# EasyEDA schematic SCH_Pico Keyboard V2.0_2022-02-22.json

## Sheets
1 Mtrix
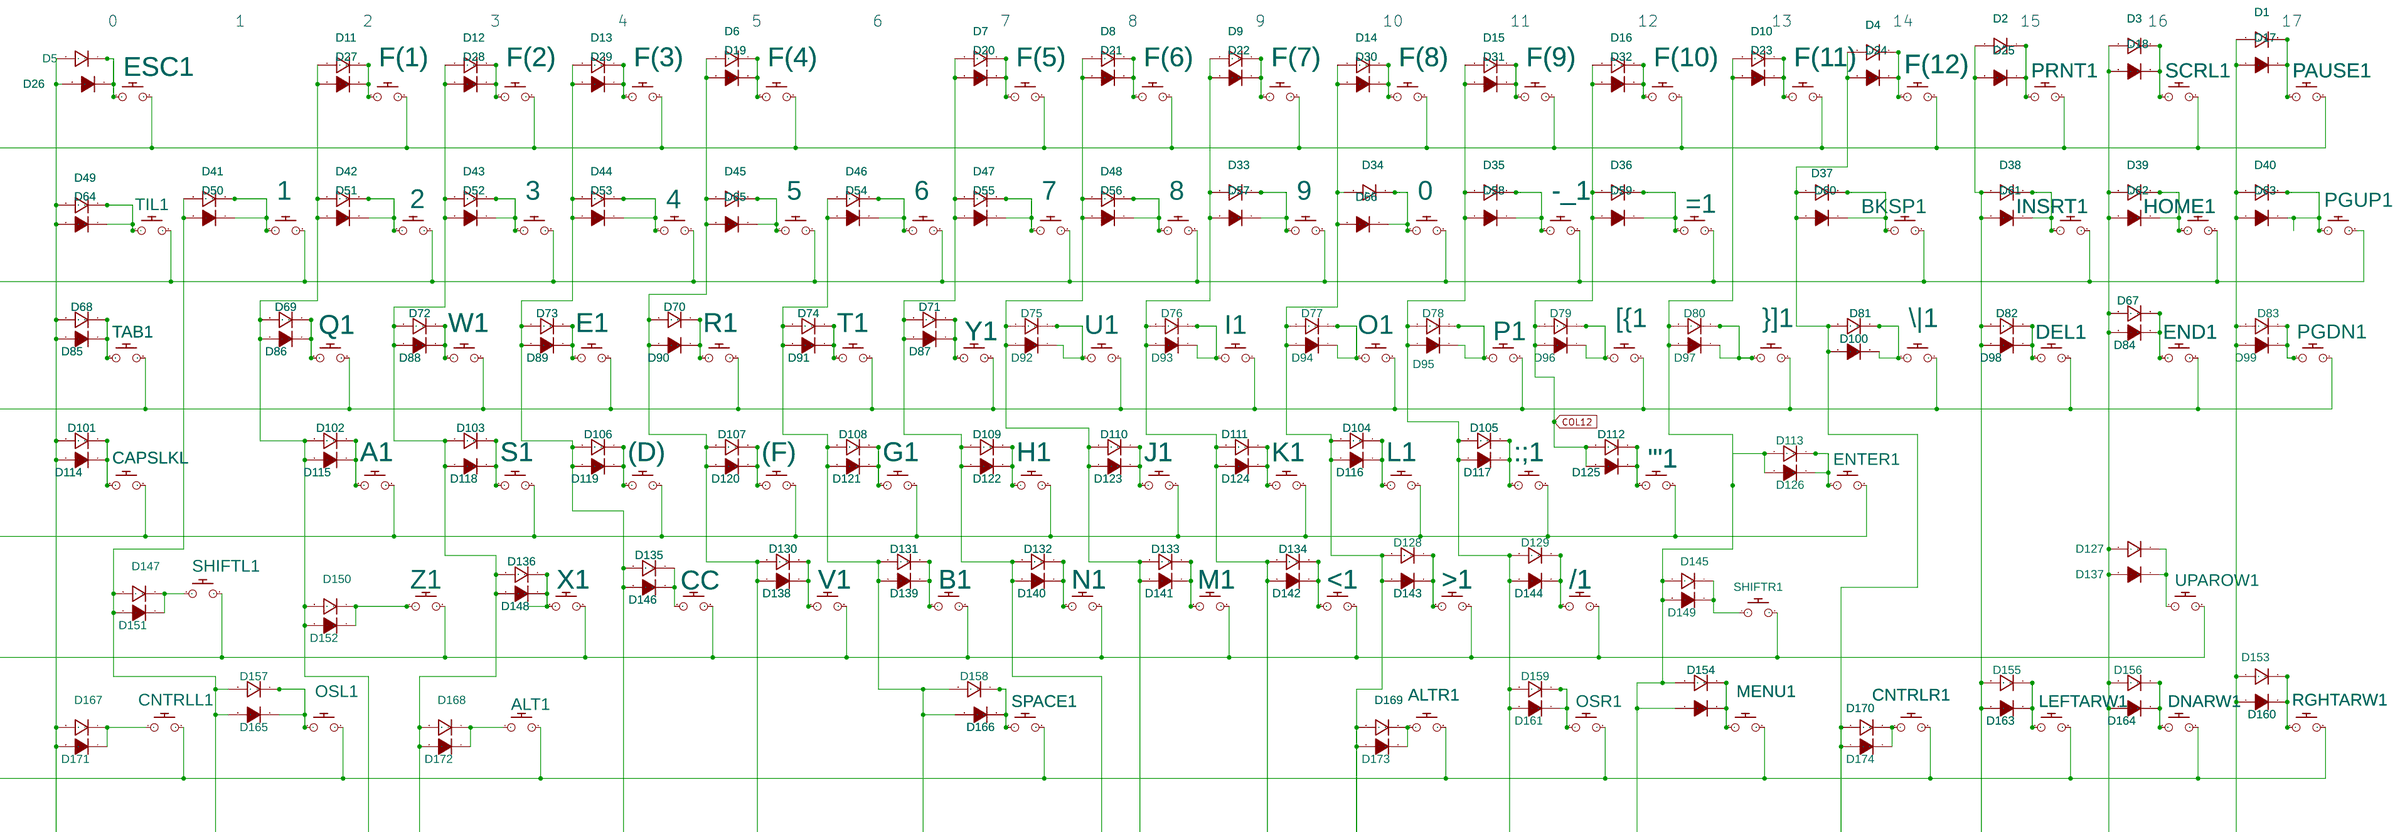
[diagram p0: Mtrix]
2 Pico
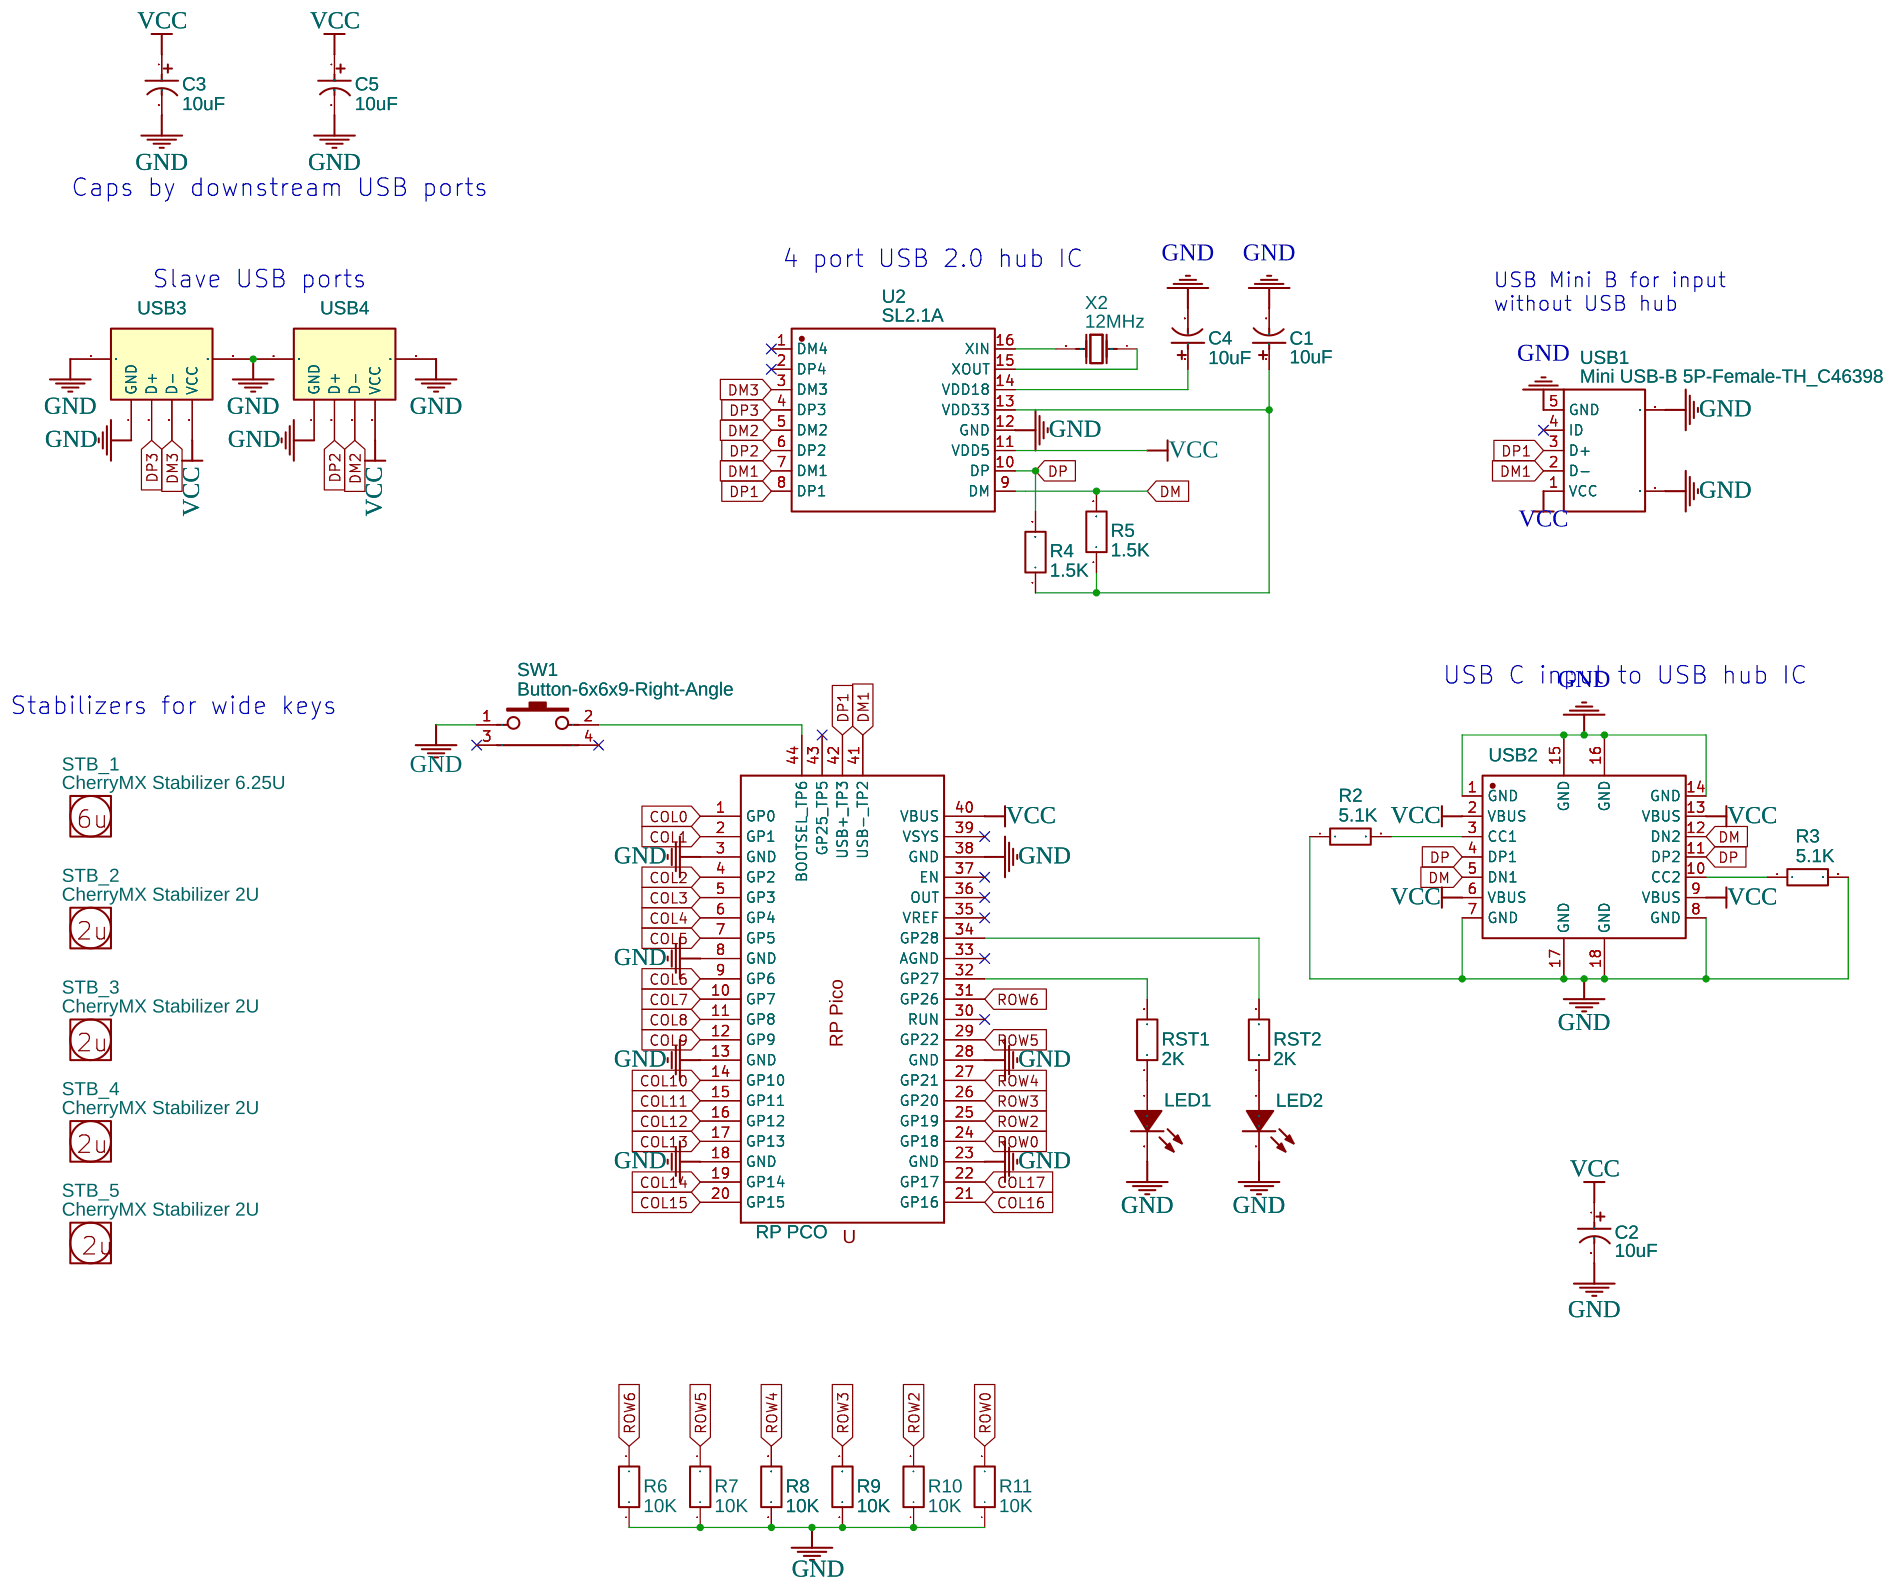
[diagram p1: Pico]

## Parts
sheet Mtrix
0  Cherry MX  [CHERRY MX]
1  Cherry MX  [CHERRY MX]
2  Cherry MX  [CHERRY MX]
3  Cherry MX  [CHERRY MX]
4  Cherry MX  [CHERRY MX]
5  Cherry MX  [CHERRY MX]
6  Cherry MX  [CHERRY MX]
7  Cherry MX  [CHERRY MX]
8  Cherry MX  [CHERRY MX]
9  Cherry MX  [CHERRY MX]
'"1  Cherry MX  [CHERRY MX]
(D)  Cherry MX  [CHERRY MX]
(F)  Cherry MX  [CHERRY MX]
-_1  Cherry MX  [CHERRY MX]
/1  Cherry MX  [CHERRY MX]
:;1  Cherry MX  [CHERRY MX]
<1  Cherry MX  [CHERRY MX]
=1  Cherry MX  [CHERRY MX]
>1  Cherry MX  [CHERRY MX]
[{1  Cherry MX  [CHERRY MX]
\|1  Cherry MX  [CHERRY MX]
A1  Cherry MX  [CHERRY MX]
ALT1  Cherry MX  [CHERRY MX]
ALTR1  Cherry MX  [CHERRY MX]
B1  Cherry MX  [CHERRY MX]
BKSP1  Cherry MX  [CHERRY MX]
CAPSLKL  Cherry MX  [CHERRY MX]
CC  Cherry MX  [CHERRY MX]
CNTRLL1  Cherry MX  [CHERRY MX]
CNTRLR1  Cherry MX  [CHERRY MX]
D1  1N4148-C163750  [DO-35_BD2.0-L4.2-P8.20-D0.5-RD]
D2  1N4148-C163750  [DO-35_BD2.0-L4.2-P8.20-D0.5-RD]
D3  1N4148-C163750  [DO-35_BD2.0-L4.2-P8.20-D0.5-RD]
D4  1N4148-C163750  [DO-35_BD2.0-L4.2-P8.20-D0.5-RD]
D5  1N4148-C163750  [DO-35_BD2.0-L4.2-P8.20-D0.5-RD]
D6  1N4148-C163750  [DO-35_BD2.0-L4.2-P8.20-D0.5-RD]
D7  1N4148-C163750  [DO-35_BD2.0-L4.2-P8.20-D0.5-RD]
D8  1N4148-C163750  [DO-35_BD2.0-L4.2-P8.20-D0.5-RD]
D9  1N4148-C163750  [DO-35_BD2.0-L4.2-P8.20-D0.5-RD]
D10  1N4148-C163750  [DO-35_BD2.0-L4.2-P8.20-D0.5-RD]
D11  1N4148-C163750  [DO-35_BD2.0-L4.2-P8.20-D0.5-RD]
D12  1N4148-C163750  [DO-35_BD2.0-L4.2-P8.20-D0.5-RD]
D13  1N4148-C163750  [DO-35_BD2.0-L4.2-P8.20-D0.5-RD]
D14  1N4148-C163750  [DO-35_BD2.0-L4.2-P8.20-D0.5-RD]
D15  1N4148-C163750  [DO-35_BD2.0-L4.2-P8.20-D0.5-RD]
D16  1N4148-C163750  [DO-35_BD2.0-L4.2-P8.20-D0.5-RD]
D17  1N4148WS T4  [SOD-323_L1.8-W1.3-LS2.5-RD]
D18  1N4148WS T4  [SOD-323_L1.8-W1.3-LS2.5-RD]
D19  1N4148WS T4  [SOD-323_L1.8-W1.3-LS2.5-RD]
D20  1N4148WS T4  [SOD-323_L1.8-W1.3-LS2.5-RD]
D21  1N4148WS T4  [SOD-323_L1.8-W1.3-LS2.5-RD]
D22  1N4148WS T4  [SOD-323_L1.8-W1.3-LS2.5-RD]
D23  1N4148WS T4  [SOD-323_L1.8-W1.3-LS2.5-RD]
D24  1N4148WS T4  [SOD-323_L1.8-W1.3-LS2.5-RD]
D25  1N4148WS T4  [SOD-323_L1.8-W1.3-LS2.5-RD]
D26  1N4148WS T4  [SOD-323_L1.8-W1.3-LS2.5-RD]
D27  1N4148WS T4  [SOD-323_L1.8-W1.3-LS2.5-RD]
D28  1N4148WS T4  [SOD-323_L1.8-W1.3-LS2.5-RD]
D29  1N4148WS T4  [SOD-323_L1.8-W1.3-LS2.5-RD]
D30  1N4148WS T4  [SOD-323_L1.8-W1.3-LS2.5-RD]
D31  1N4148WS T4  [SOD-323_L1.8-W1.3-LS2.5-RD]
D32  1N4148WS T4  [SOD-323_L1.8-W1.3-LS2.5-RD]
D33  1N4148-C163750  [DO-35_BD2.0-L4.2-P8.20-D0.5-RD]
D34  1N4148-C163750  [DO-35_BD2.0-L4.2-P8.20-D0.5-RD]
D35  1N4148-C163750  [DO-35_BD2.0-L4.2-P8.20-D0.5-RD]
D36  1N4148-C163750  [DO-35_BD2.0-L4.2-P8.20-D0.5-RD]
D37  1N4148-C163750  [DO-35_BD2.0-L4.2-P8.20-D0.5-RD]
D38  1N4148-C163750  [DO-35_BD2.0-L4.2-P8.20-D0.5-RD]
D39  1N4148-C163750  [DO-35_BD2.0-L4.2-P8.20-D0.5-RD]
D40  1N4148-C163750  [DO-35_BD2.0-L4.2-P8.20-D0.5-RD]
D41  1N4148-C163750  [DO-35_BD2.0-L4.2-P8.20-D0.5-RD]
D42  1N4148-C163750  [DO-35_BD2.0-L4.2-P8.20-D0.5-RD]
D43  1N4148-C163750  [DO-35_BD2.0-L4.2-P8.20-D0.5-RD]
D44  1N4148-C163750  [DO-35_BD2.0-L4.2-P8.20-D0.5-RD]
D45  1N4148-C163750  [DO-35_BD2.0-L4.2-P8.20-D0.5-RD]
D46  1N4148-C163750  [DO-35_BD2.0-L4.2-P8.20-D0.5-RD]
D47  1N4148-C163750  [DO-35_BD2.0-L4.2-P8.20-D0.5-RD]
D48  1N4148-C163750  [DO-35_BD2.0-L4.2-P8.20-D0.5-RD]
D49  1N4148-C163750  [DO-35_BD2.0-L4.2-P8.20-D0.5-RD]
D50  1N4148WS T4  [SOD-323_L1.8-W1.3-LS2.5-RD]
D51  1N4148WS T4  [SOD-323_L1.8-W1.3-LS2.5-RD]
D52  1N4148WS T4  [SOD-323_L1.8-W1.3-LS2.5-RD]
D53  1N4148WS T4  [SOD-323_L1.8-W1.3-LS2.5-RD]
D54  1N4148WS T4  [SOD-323_L1.8-W1.3-LS2.5-RD]
D55  1N4148WS T4  [SOD-323_L1.8-W1.3-LS2.5-RD]
D56  1N4148WS T4  [SOD-323_L1.8-W1.3-LS2.5-RD]
D57  1N4148WS T4  [SOD-323_L1.8-W1.3-LS2.5-RD]
D58  1N4148WS T4  [SOD-323_L1.8-W1.3-LS2.5-RD]
D59  1N4148WS T4  [SOD-323_L1.8-W1.3-LS2.5-RD]
D60  1N4148WS T4  [SOD-323_L1.8-W1.3-LS2.5-RD]
D61  1N4148WS T4  [SOD-323_L1.8-W1.3-LS2.5-RD]
D62  1N4148WS T4  [SOD-323_L1.8-W1.3-LS2.5-RD]
D63  1N4148WS T4  [SOD-323_L1.8-W1.3-LS2.5-RD]
D64  1N4148WS T4  [SOD-323_L1.8-W1.3-LS2.5-RD]
D65  1N4148WS T4  [SOD-323_L1.8-W1.3-LS2.5-RD]
D66  1N4148WS T4  [SOD-323_L1.8-W1.3-LS2.5-RD]
D67  1N4148-C163750  [DO-35_BD2.0-L4.2-P8.20-D0.5-RD]
D68  1N4148-C163750  [DO-35_BD2.0-L4.2-P8.20-D0.5-RD]
D69  1N4148-C163750  [DO-35_BD2.0-L4.2-P8.20-D0.5-RD]
D70  1N4148-C163750  [DO-35_BD2.0-L4.2-P8.20-D0.5-RD]
D71  1N4148-C163750  [DO-35_BD2.0-L4.2-P8.20-D0.5-RD]
D72  1N4148-C163750  [DO-35_BD2.0-L4.2-P8.20-D0.5-RD]
D73  1N4148-C163750  [DO-35_BD2.0-L4.2-P8.20-D0.5-RD]
D74  1N4148-C163750  [DO-35_BD2.0-L4.2-P8.20-D0.5-RD]
D75  1N4148-C163750  [DO-35_BD2.0-L4.2-P8.20-D0.5-RD]
D76  1N4148-C163750  [DO-35_BD2.0-L4.2-P8.20-D0.5-RD]
D77  1N4148-C163750  [DO-35_BD2.0-L4.2-P8.20-D0.5-RD]
D78  1N4148-C163750  [DO-35_BD2.0-L4.2-P8.20-D0.5-RD]
D79  1N4148-C163750  [DO-35_BD2.0-L4.2-P8.20-D0.5-RD]
D80  1N4148-C163750  [DO-35_BD2.0-L4.2-P8.20-D0.5-RD]
D81  1N4148-C163750  [DO-35_BD2.0-L4.2-P8.20-D0.5-RD]
D82  1N4148-C163750  [DO-35_BD2.0-L4.2-P8.20-D0.5-RD]
D83  1N4148-C163750  [DO-35_BD2.0-L4.2-P8.20-D0.5-RD]
D84  1N4148WS T4  [SOD-323_L1.8-W1.3-LS2.5-RD]
D85  1N4148WS T4  [SOD-323_L1.8-W1.3-LS2.5-RD]
D86  1N4148WS T4  [SOD-323_L1.8-W1.3-LS2.5-RD]
D87  1N4148WS T4  [SOD-323_L1.8-W1.3-LS2.5-RD]
D88  1N4148WS T4  [SOD-323_L1.8-W1.3-LS2.5-RD]
D89  1N4148WS T4  [SOD-323_L1.8-W1.3-LS2.5-RD]
D90  1N4148WS T4  [SOD-323_L1.8-W1.3-LS2.5-RD]
D91  1N4148WS T4  [SOD-323_L1.8-W1.3-LS2.5-RD]
D92  1N4148WS T4  [SOD-323_L1.8-W1.3-LS2.5-RD]
D93  1N4148WS T4  [SOD-323_L1.8-W1.3-LS2.5-RD]
D94  1N4148WS T4  [SOD-323_L1.8-W1.3-LS2.5-RD]
D95  1N4148WS T4  [SOD-323_L1.8-W1.3-LS2.5-RD]
D96  1N4148WS T4  [SOD-323_L1.8-W1.3-LS2.5-RD]
D97  1N4148WS T4  [SOD-323_L1.8-W1.3-LS2.5-RD]
D98  1N4148WS T4  [SOD-323_L1.8-W1.3-LS2.5-RD]
D99  1N4148WS T4  [SOD-323_L1.8-W1.3-LS2.5-RD]
D100  1N4148WS T4  [SOD-323_L1.8-W1.3-LS2.5-RD]
D101  1N4148-C163750  [DO-35_BD2.0-L4.2-P8.20-D0.5-RD]
D102  1N4148-C163750  [DO-35_BD2.0-L4.2-P8.20-D0.5-RD]
D103  1N4148-C163750  [DO-35_BD2.0-L4.2-P8.20-D0.5-RD]
D104  1N4148-C163750  [DO-35_BD2.0-L4.2-P8.20-D0.5-RD]
D105  1N4148-C163750  [DO-35_BD2.0-L4.2-P8.20-D0.5-RD]
D106  1N4148-C163750  [DO-35_BD2.0-L4.2-P8.20-D0.5-RD]
D107  1N4148-C163750  [DO-35_BD2.0-L4.2-P8.20-D0.5-RD]
D108  1N4148-C163750  [DO-35_BD2.0-L4.2-P8.20-D0.5-RD]
D109  1N4148-C163750  [DO-35_BD2.0-L4.2-P8.20-D0.5-RD]
D110  1N4148-C163750  [DO-35_BD2.0-L4.2-P8.20-D0.5-RD]
D111  1N4148-C163750  [DO-35_BD2.0-L4.2-P8.20-D0.5-RD]
D112  1N4148-C163750  [DO-35_BD2.0-L4.2-P8.20-D0.5-RD]
D113  1N4148-C163750  [DO-35_BD2.0-L4.2-P8.20-D0.5-RD]
D114  1N4148WS T4  [SOD-323_L1.8-W1.3-LS2.5-RD]
D115  1N4148WS T4  [SOD-323_L1.8-W1.3-LS2.5-RD]
D116  1N4148WS T4  [SOD-323_L1.8-W1.3-LS2.5-RD]
D117  1N4148WS T4  [SOD-323_L1.8-W1.3-LS2.5-RD]
D118  1N4148WS T4  [SOD-323_L1.8-W1.3-LS2.5-RD]
D119  1N4148WS T4  [SOD-323_L1.8-W1.3-LS2.5-RD]
D120  1N4148WS T4  [SOD-323_L1.8-W1.3-LS2.5-RD]
D121  1N4148WS T4  [SOD-323_L1.8-W1.3-LS2.5-RD]
D122  1N4148WS T4  [SOD-323_L1.8-W1.3-LS2.5-RD]
D123  1N4148WS T4  [SOD-323_L1.8-W1.3-LS2.5-RD]
D124  1N4148WS T4  [SOD-323_L1.8-W1.3-LS2.5-RD]
D125  1N4148WS T4  [SOD-323_L1.8-W1.3-LS2.5-RD]
D126  1N4148WS T4  [SOD-323_L1.8-W1.3-LS2.5-RD]
D127  1N4148-C163750  [DO-35_BD2.0-L4.2-P8.20-D0.5-RD]
D128  1N4148-C163750  [DO-35_BD2.0-L4.2-P8.20-D0.5-RD]
D129  1N4148-C163750  [DO-35_BD2.0-L4.2-P8.20-D0.5-RD]
D130  1N4148-C163750  [DO-35_BD2.0-L4.2-P8.20-D0.5-RD]
D131  1N4148-C163750  [DO-35_BD2.0-L4.2-P8.20-D0.5-RD]
D132  1N4148-C163750  [DO-35_BD2.0-L4.2-P8.20-D0.5-RD]
D133  1N4148-C163750  [DO-35_BD2.0-L4.2-P8.20-D0.5-RD]
D134  1N4148-C163750  [DO-35_BD2.0-L4.2-P8.20-D0.5-RD]
D135  1N4148-C163750  [DO-35_BD2.0-L4.2-P8.20-D0.5-RD]
D136  1N4148-C163750  [DO-35_BD2.0-L4.2-P8.20-D0.5-RD]
D137  1N4148WS T4  [SOD-323_L1.8-W1.3-LS2.5-RD]
D138  1N4148WS T4  [SOD-323_L1.8-W1.3-LS2.5-RD]
D139  1N4148WS T4  [SOD-323_L1.8-W1.3-LS2.5-RD]
D140  1N4148WS T4  [SOD-323_L1.8-W1.3-LS2.5-RD]
D141  1N4148WS T4  [SOD-323_L1.8-W1.3-LS2.5-RD]
D142  1N4148WS T4  [SOD-323_L1.8-W1.3-LS2.5-RD]
D143  1N4148WS T4  [SOD-323_L1.8-W1.3-LS2.5-RD]
D144  1N4148WS T4  [SOD-323_L1.8-W1.3-LS2.5-RD]
D145  1N4148-C163750  [DO-35_BD2.0-L4.2-P8.20-D0.5-RD]
D146  1N4148WS T4  [SOD-323_L1.8-W1.3-LS2.5-RD]
D147  1N4148-C163750  [DO-35_BD2.0-L4.2-P8.20-D0.5-RD]
D148  1N4148WS T4  [SOD-323_L1.8-W1.3-LS2.5-RD]
D149  1N4148WS T4  [SOD-323_L1.8-W1.3-LS2.5-RD]
D150  1N4148-C163750  [DO-35_BD2.0-L4.2-P8.20-D0.5-RD]
D151  1N4148WS T4  [SOD-323_L1.8-W1.3-LS2.5-RD]
D152  1N4148WS T4  [SOD-323_L1.8-W1.3-LS2.5-RD]
D153  1N4148-C163750  [DO-35_BD2.0-L4.2-P8.20-D0.5-RD]
D154  1N4148-C163750  [DO-35_BD2.0-L4.2-P8.20-D0.5-RD]
D155  1N4148-C163750  [DO-35_BD2.0-L4.2-P8.20-D0.5-RD]
D156  1N4148-C163750  [DO-35_BD2.0-L4.2-P8.20-D0.5-RD]
D157  1N4148-C163750  [DO-35_BD2.0-L4.2-P8.20-D0.5-RD]
D158  1N4148-C163750  [DO-35_BD2.0-L4.2-P8.20-D0.5-RD]
D159  1N4148-C163750  [DO-35_BD2.0-L4.2-P8.20-D0.5-RD]
D160  1N4148WS T4  [SOD-323_L1.8-W1.3-LS2.5-RD]
D161  1N4148WS T4  [SOD-323_L1.8-W1.3-LS2.5-RD]
D162  1N4148WS T4  [SOD-323_L1.8-W1.3-LS2.5-RD]
D163  1N4148WS T4  [SOD-323_L1.8-W1.3-LS2.5-RD]
D164  1N4148WS T4  [SOD-323_L1.8-W1.3-LS2.5-RD]
D165  1N4148WS T4  [SOD-323_L1.8-W1.3-LS2.5-RD]
D166  1N4148WS T4  [SOD-323_L1.8-W1.3-LS2.5-RD]
D167  1N4148-C163750  [DO-35_BD2.0-L4.2-P8.20-D0.5-RD]
D168  1N4148-C163750  [DO-35_BD2.0-L4.2-P8.20-D0.5-RD]
D169  1N4148-C163750  [DO-35_BD2.0-L4.2-P8.20-D0.5-RD]
D170  1N4148-C163750  [DO-35_BD2.0-L4.2-P8.20-D0.5-RD]
D171  1N4148WS T4  [SOD-323_L1.8-W1.3-LS2.5-RD]
D172  1N4148WS T4  [SOD-323_L1.8-W1.3-LS2.5-RD]
D173  1N4148WS T4  [SOD-323_L1.8-W1.3-LS2.5-RD]
D174  1N4148WS T4  [SOD-323_L1.8-W1.3-LS2.5-RD]
DEL1  Cherry MX  [CHERRY MX]
DNARW1  Cherry MX  [CHERRY MX]
E1  Cherry MX  [CHERRY MX]
END1  Cherry MX  [CHERRY MX]
ENTER1  Cherry MX  [CHERRY MX]
ESC1  Cherry MX  [CHERRY MX]
F(1)  Cherry MX  [CHERRY MX]
F(2)  Cherry MX  [CHERRY MX]
F(3)  Cherry MX  [CHERRY MX]
F(4)  Cherry MX  [CHERRY MX]
F(5)  Cherry MX  [CHERRY MX]
F(6)  Cherry MX  [CHERRY MX]
F(7)  Cherry MX  [CHERRY MX]
F(8)  Cherry MX  [CHERRY MX]
F(9)  Cherry MX  [CHERRY MX]
F(10)  Cherry MX  [CHERRY MX]
F(11)  Cherry MX  [CHERRY MX]
F(12)  Cherry MX  [CHERRY MX]
G1  Cherry MX  [CHERRY MX]
H1  Cherry MX  [CHERRY MX]
HOME1  Cherry MX  [CHERRY MX]
I1  Cherry MX  [CHERRY MX]
INSRT1  Cherry MX  [CHERRY MX]
J1  Cherry MX  [CHERRY MX]
K1  Cherry MX  [CHERRY MX]
L1  Cherry MX  [CHERRY MX]
LEFTARW1  Cherry MX  [CHERRY MX]
M1  Cherry MX  [CHERRY MX]
MENU1  Cherry MX  [CHERRY MX]
N1  Cherry MX  [CHERRY MX]
O1  Cherry MX  [CHERRY MX]
OSL1  Cherry MX  [CHERRY MX]
OSR1  Cherry MX  [CHERRY MX]
P1  Cherry MX  [CHERRY MX]
PAUSE1  Cherry MX  [CHERRY MX]
PGDN1  Cherry MX  [CHERRY MX]
PGUP1  Cherry MX  [CHERRY MX]
PRNT1  Cherry MX  [CHERRY MX]
Q1  Cherry MX  [CHERRY MX]
R1  Cherry MX  [CHERRY MX]
RGHTARW1  Cherry MX  [CHERRY MX]
S1  Cherry MX  [CHERRY MX]
SCRL1  Cherry MX  [CHERRY MX]
SHIFTL1  Cherry MX  [CHERRY MX]
SHIFTR1  Cherry MX  [CHERRY MX]
SPACE1  Cherry MX  [CHERRY MX]
T1  Cherry MX  [CHERRY MX]
TAB1  Cherry MX  [CHERRY MX]
TIL1  Cherry MX  [CHERRY MX]
U1  Cherry MX  [CHERRY MX]
UPAROW1  Cherry MX  [CHERRY MX]
V1  Cherry MX  [CHERRY MX]
W1  Cherry MX  [CHERRY MX]
X1  Cherry MX  [CHERRY MX]
Y1  Cherry MX  [CHERRY MX]
Z1  Cherry MX  [CHERRY MX]
}]1  Cherry MX  [CHERRY MX]
sheet Pico
C1  10uF  [CAP-TH_BD4.0-P1.50-D0.8-FD]
C2  10uF  [CAP-TH_BD4.0-P1.50-D0.8-FD]
C3  10uF  [CAP-TH_BD4.0-P1.50-D0.8-FD]
C4  10uF  [CAP-TH_BD4.0-P1.50-D0.8-FD]
C5  10uF  [CAP-TH_BD4.0-P1.50-D0.8-FD]
LED1  LED1  [LED 5MM]
LED2  LED1  [LED 5MM]
R2  5.1K  [RES-TH_BD2.3-L6.5-P10.50-D0.5]
R3  5.1K  [RES-TH_BD2.3-L6.5-P10.50-D0.5]
R4  1.5K  [RES-TH_BD2.4-L6.3-P10.30-D0.6]
R5  1.5K  [RES-TH_BD2.4-L6.3-P10.30-D0.6]
R6  10K  [RES-TH_BD2.4-L6.3-P10.30-D0.6]
R7  10K  [RES-TH_BD2.4-L6.3-P10.30-D0.6]
R8  10K  [RES-TH_BD2.4-L6.3-P10.30-D0.6]
R9  10K  [RES-TH_BD2.4-L6.3-P10.30-D0.6]
R10  10K  [RES-TH_BD2.4-L6.3-P10.30-D0.6]
R11  10K  [RES-TH_BD2.4-L6.3-P10.30-D0.6]
RPP  RP PCO  [RP PCO]
RST1  2K  [RES-TH_BD2.4-L6.3-P10.30-D0.6]
RST2  2K  [RES-TH_BD2.4-L6.3-P10.30-D0.6]
STB_1  CherryMX Stabilizer 6.25U  [CHERRYMX STABILIZER 6.25U]
STB_2  CherryMX Stabilizer 2U  [CHERRYMX STABILIZER 2U]
STB_3  CherryMX Stabilizer 2U  [CHERRYMX STABILIZER 2U]
STB_4  CherryMX Stabilizer 2U  [CHERRYMX STABILIZER 2U]
STB_5  CherryMX Stabilizer 2U  [CHERRYMX STABILIZER 2U]
SW1  Button-6x6x9-Right-Angle  [SW-TH_BBJ]
U2  SL2.1A  [SOP-16_L10.0-W3.9-P1.27-LS6.0-BL]
USB1  Mini USB-B 5P-Female-TH_C46398  [MINI-USB-TH_USB-MINI-2]
USB2  U264-141N-4BAC10  [U264-141N-4BAC10]
USB3  A/F90degree Dparagraph10.6 PBTWhite plastic6.2-C42459  [USB-A-TH_USB-M-14-F]
USB4  A/F90degree Dparagraph10.6 PBTWhite plastic6.2-C42459  [USB-A-TH_USB-M-14-F]
X2  12MHz  [HC-49US_L11.5-W4.5-P4.88]

## Library data of the parts
0-9 '"1 (D) (F) -_1 /1 :;1 <1 =1 >1 [{1 \|1 A1 ALT1 ALTR1 B1 BKSP1 CAPSLKL CC CNTRLL1 CNTRLR1 DEL1 DNARW1 E1 END1 ENTER1 ESC1 F(1) F(2) F(3) F(4) F(5) F(6) F(7) F(8) F(9) F(10) F(11) F(12) G1 H1 HOME1 I1 INSRT1 J1 K1 L1 LEFTARW1 M1 MENU1 N1 O1 OSL1 OSR1 P1 PAUSE1 PGDN1 PGUP1 PRNT1 Q1 R1 RGHTARW1 S1 SCRL1 SHIFTL1 SHIFTR1 SPACE1 T1 TAB1 TIL1 U1 UPAROW1 V1 W1 X1 Y1 Z1 }]1 = Cherry MX: Contributor: idunn; Supplier Part: MX1A-G1NW; Supplier: Reichelt; Manufacturer Part: MX; Manufacturer: CherryMX; link: https://www.cherrymx.de/_Resources/Persistent/0d02c435189d71492e5a897bcc1c545907d1b283/DE_CHERRY_MX_BROWN.pdf
D1-D16 D33-D49 D67-D83 D101-D113 D127-D136 D145 D147 D150 D153-D159 D167-D170 = 1N4148-C163750: Supplier Part: C163750; Supplier: LCSC; Manufacturer: FMS; Manufacturer Part: 1N4148; Contributor: LCSC; JLCPCB Part Class: Extended Part
D17-D32 D50-D66 D84-D100 D114-D126 D137-D144 D146 D148 D149 D151 D152 D160-D166 D171-D174 = 1N4148WS T4: Supplier: LCSC; Manufacturer: CJ; Supplier Part: C2128; JLCPCB Part Class: Basic Part
C1-C5 = 10uF 25V 4*5: Supplier: LCSC; Manufacturer: ValuePro; Supplier Part: C43846; JLCPCB Part Class: Extended Part
LED1 LED2 = LED 5MM: Contributor: idunn
R2 R3 = CF1/4W-5.1KΩ±5% T52: Supplier: LCSC; Supplier Part: C120072; Manufacturer: Chian Chia Elec; Contributor: LCSC; JLCPCB Part Class: Extended Part
R4 R5 = RD 1/4W 1K5 J T/B A1: Supplier: LCSC; Supplier Part: C433764; Manufacturer: TyoHM; Contributor: LCSC; JLCPCB Part Class: Extended Part
R6-R11 = RD 1/4W 10K J T/B A1: Supplier: LCSC; Supplier Part: C433778; Manufacturer: TyoHM; Contributor: LCSC; JLCPCB Part Class: Extended Part
RPP = RP PCO: link: www.boltind.com; Contributor: idunn
RST1 RST2 = RD 1/4W 2K J T/B A1: Supplier: LCSC; Supplier Part: C433754; Manufacturer: TyoHM; Contributor: LCSC; JLCPCB Part Class: Extended Part
STB_1 = CherryMX Stabilizer 6.25U: Manufacturer Part: Cherry MX Stabilizer 6.25
STB_2-STB_5 = CherryMX Stabilizer 2U: Manufacturer Part: G99-0742; link: http://www.mouser.com/ds/2/71/mx_cat-1079739.pdf; Supplier Part: 540-G99-0742; Supplier: Mouser
SW1 = Button-6x6x9-Right-Angle: Supplier Part: C71842; Supplier: LCSC; Manufacturer: BBJ; Manufacturer Part: Switch,6*6*9Plastic head,260G, 0.25mm,Side bracket
U2 = SL2.1A: Supplier: LCSC; Supplier Part: C192893; Manufacturer: CoreChips; Contributor: LCSC; JLCPCB Part Class: Extended Part
USB1 = Mini USB-B 5P-Female-TH_C46398: Supplier: LCSC; Manufacturer: ValuePro; Manufacturer Part: MINI 5PFemale90Degree plate four feet copper shell LCPVinyl; Supplier Part: C46398; JLCPCB Part Class: Extended Part
USB2 = U264-141N-4BAC10: Contributor: idunn
USB3 USB4 = A/F90degree Dparagraph10.6 PBTWhite plastic6.2-C42459: Supplier: LCSC; Manufacturer: ValuePro; Manufacturer Part: A/F90degree Dparagraph10.6 PBTWhite plastic6.2; Supplier Part: C42459; Contributor: 立创EDA官方封装库; JLCPCB Part Class: Extended Part
X2 = X49SD12MSD2SC: Supplier: LCSC; Manufacturer: YXC; Supplier Part: C16369; JLCPCB Part Class: Extended Part

## Nets
GND: C1.2 C2.2 C3.2 C4.2 C5.2 LED1.2(K) LED2.2(K) R2.1 R3.2 R6.1 R7.1 R8.1 R9.1 R10.1 R11.1 RPP.3(GND) RPP.8(GND) RPP.13(GND) RPP.18(GND) RPP.23(GND) RPP.28(GND) RPP.38(GND) SW1.1 U2.12(GND) USB1.0 USB1.5(GND) USB2.1(GND) USB2.7(GND) USB2.8(GND) USB2.14(GND) USB2.15(GND) USB2.16(GND) USB2.17(GND) USB2.18(GND) USB3.4(GND) USB3.5 USB3.6 USB4.4(GND) USB4.5 USB4.6
VCC: C2.1 C3.1 C5.1 RPP.40(VBUS) U2.11(VDD5) USB1.1(VCC) USB2.2(VBUS) USB2.6(VBUS) USB2.9(VBUS) USB2.13(VBUS) USB3.1(VCC) USB4.1(VCC)
COL0: D5.2 D26.2(A) D49.2 D64.2(A) D68.2 D85.2(A) D101.2 D114.2(A) D167.2 D171.2(A) RPP.1(GP0)
COL1: D41.2 D50.2(A) D147.2 D151.2(A) D157.2 D165.2(A) RPP.2(GP1)
COL2: D11.2 D27.2(A) D42.2 D51.2(A) D69.2 D86.2(A) D102.2 D115.2(A) D150.2 D152.2(A) RPP.4(GP2)
COL3: D12.2 D28.2(A) D43.2 D52.2(A) D72.2 D88.2(A) D103.2 D118.2(A) D136.2 D148.2(A) D168.2 D172.2(A) RPP.5(GP3)
COL4: D13.2 D29.2(A) D44.2 D53.2(A) D73.2 D89.2(A) D106.2 D119.2(A) D135.2 D146.2(A) RPP.6(GP4)
COL5: D6.2 D19.2(A) D45.2 D65.2(A) D70.2 D90.2(A) D107.2 D120.2(A) D130.2 D138.2(A) RPP.7(GP5)
COL6: D46.2 D54.2(A) D74.2 D91.2(A) D108.2 D121.2(A) D131.2 D139.2(A) D158.2 D166.2(A) RPP.9(GP6)
COL7: D7.2 D20.2(A) D47.2 D55.2(A) D71.2 D87.2(A) D109.2 D122.2(A) D132.2 D140.2(A) RPP.10(GP7)
COL8: D8.2 D21.2(A) D48.2 D56.2(A) D75.2 D92.2(A) D110.2 D123.2(A) D133.2 D141.2(A) RPP.11(GP8)
COL9: D9.2 D22.2(A) D33.2 D57.2(A) D76.2 D93.2(A) D111.2 D124.2(A) D134.2 D142.2(A) RPP.12(GP9)
COL10: D14.2 D30.2(A) D34.2 D66.2(A) D77.2 D94.2(A) D104.2 D116.2(A) D128.2 D143.2(A) D169.2 D173.2(A) RPP.14(GP10)
COL11: D15.2 D31.2(A) D35.2 D58.2(A) D78.2 D95.2(A) D105.2 D117.2(A) D129.2 D144.2(A) D159.2 D161.2(A) RPP.15(GP11)
COL12: D16.2 D32.2(A) D36.2 D59.2(A) D79.2 D96.2(A) D112.2 D125.2(A) RPP.16(GP12)
COL13: D10.2 D23.2(A) D80.2 D97.2(A) D113.2 D126.2(A) D145.2 D149.2(A) D154.2 D162.2(A) RPP.17(GP13)
COL14: D4.2 D24.2(A) D37.2 D60.2(A) D81.2 D100.2(A) D170.2 D174.2(A) RPP.19(GP14)
COL15: D2.2 D25.2(A) D38.2 D61.2(A) D82.2 D98.2(A) D155.2 D163.2(A) RPP.20(GP15)
COL16: D3.2 D18.2(A) D39.2 D62.2(A) D67.2 D84.2(A) D127.2 D137.2(A) D156.2 D164.2(A) RPP.21(GP16)
COL17: D1.2 D17.2(A) D40.2 D63.2(A) D83.2 D99.2(A) D153.2 D160.2(A) RPP.22(GP17)
DM: R5.2 U2.9(DM) USB2.5(DN1) USB2.12(DN2)
DM1: RPP.41(USB- TP2) U2.7(DM1) USB1.2(D-)
DM2: U2.5(DM2) USB4.2(D-)
DM3: U2.3(DM3) USB3.2(D-)
DP: R4.2 U2.10(DP) USB2.4(DP1) USB2.11(DP2)
DP1: RPP.42(USB+ TP3) U2.8(DP1) USB1.3(D+)
DP2: U2.6(DP2) USB4.3(D+)
DP3: U2.4(DP3) USB3.3(D+)
ROW0: ESC1.2 F(1).2 F(2).2 F(3).2 F(4).2 F(5).2 F(6).2 F(7).2 F(8).2 F(9).2 F(10).2 F(11).2 F(12).2 PAUSE1.2 PRNT1.2 R11.2 RPP.24(GP18) SCRL1.2
ROW2: 0.2 1.2 2.2 3.2 4.2 5.2 6.2 7.2 8.2 9.2 -_1.2 =1.2 BKSP1.2 HOME1.2 INSRT1.2 PGUP1.2 R10.2 RPP.25(GP19) TIL1.2
ROW3: [{1.2 \|1.2 DEL1.2 E1.2 END1.2 I1.2 O1.2 P1.2 PGDN1.2 Q1.2 R1.2 R9.2 RPP.26(GP20) T1.2 TAB1.2 U1.2 W1.2 Y1.2 }]1.2
ROW4: '"1.2 (D).2 (F).2 :;1.2 A1.2 CAPSLKL.2 ENTER1.2 G1.2 H1.2 J1.2 K1.2 L1.2 R8.2 RPP.27(GP21) S1.2
ROW5: /1.2 <1.2 >1.2 B1.2 CC.2 M1.2 N1.2 R7.2 RPP.29(GP22) SHIFTL1.2 SHIFTR1.2 UPAROW1.2 V1.2 X1.2 Z1.2
ROW6: ALT1.2 ALTR1.2 CNTRLL1.2 CNTRLR1.2 DNARW1.2 LEFTARW1.2 MENU1.2 OSL1.2 OSR1.2 R6.2 RGHTARW1.2 RPP.31(GP26) SPACE1.2
Net-(0-1): 0.1 D34.1 D66.1(K)
Net-(1-1): 1.1 D41.1 D50.1(K)
Net-(2-1): 2.1 D42.1 D51.1(K)
Net-(3-1): 3.1 D43.1 D52.1(K)
Net-(4-1): 4.1 D44.1 D53.1(K)
Net-(5-1): 5.1 D45.1 D65.1(K)
Net-(6-1): 6.1 D46.1 D54.1(K)
Net-(7-1): 7.1 D47.1 D55.1(K)
Net-(8-1): 8.1 D48.1 D56.1(K)
Net-(9-1): 9.1 D33.1 D57.1(K)
Net-('"1-1): '"1.1 D112.1 D125.1(K)
Net-((D)-1): (D).1 D106.1 D119.1(K)
Net-((F)-1): (F).1 D107.1 D120.1(K)
Net-(-_1-1): -_1.1 D35.1 D58.1(K)
Net-(/1-1): /1.1 D129.1 D144.1(K)
Net-(:;1-1): :;1.1 D105.1 D117.1(K)
Net-(<1-1): <1.1 D134.1 D142.1(K)
Net-(=1-1): =1.1 D36.1 D59.1(K)
Net-(>1-1): >1.1 D128.1 D143.1(K)
Net-([{1-1): [{1.1 D79.1 D96.1(K)
Net-(\|1-1): \|1.1 D81.1 D100.1(K)
Net-(A1-1): A1.1 D102.1 D115.1(K)
Net-(ALT1-1): ALT1.1 D168.1 D172.1(K)
Net-(ALTR1-1): ALTR1.1 D169.1 D173.1(K)
Net-(B1-1): B1.1 D131.1 D139.1(K)
Net-(BKSP1-1): BKSP1.1 D37.1 D60.1(K)
Net-(C1-1): C1.1 R4.1 R5.1 U2.13(VDD33)
Net-(C4-1): C4.1 U2.14(VDD18)
Net-(CAPSLKL-1): CAPSLKL.1 D101.1 D114.1(K)
Net-(CC-1): CC.1 D135.1 D146.1(K)
Net-(CNTRLL1-1): CNTRLL1.1 D167.1 D171.1(K)
Net-(CNTRLR1-1): CNTRLR1.1 D170.1 D174.1(K)
Net-(D1-1): D1.1 D17.1(K) PAUSE1.1
Net-(D2-1): D2.1 D25.1(K) PRNT1.1
Net-(D3-1): D3.1 D18.1(K) SCRL1.1
Net-(D4-1): D4.1 D24.1(K) F(12).1
Net-(D5-1): D5.1 D26.1(K) ESC1.1
Net-(D6-1): D6.1 D19.1(K) F(4).1
Net-(D7-1): D7.1 D20.1(K) F(5).1
Net-(D8-1): D8.1 D21.1(K) F(6).1
Net-(D9-1): D9.1 D22.1(K) F(7).1
Net-(D10-1): D10.1 D23.1(K) F(11).1
Net-(D11-1): D11.1 D27.1(K) F(1).1
Net-(D12-1): D12.1 D28.1(K) F(2).1
Net-(D13-1): D13.1 D29.1(K) F(3).1
Net-(D14-1): D14.1 D30.1(K) F(8).1
Net-(D15-1): D15.1 D31.1(K) F(9).1
Net-(D16-1): D16.1 D32.1(K) F(10).1
Net-(D38-1): D38.1 D61.1(K) INSRT1.1
Net-(D39-1): D39.1 D62.1(K) HOME1.1
Net-(D40-1): D40.1 D63.1(K) PGUP1.1
Net-(D49-1): D49.1 D64.1(K) TIL1.1
Net-(D67-1): D67.1 D84.1(K) END1.1
Net-(D68-1): D68.1 D85.1(K) TAB1.1
Net-(D69-1): D69.1 D86.1(K) Q1.1
Net-(D70-1): D70.1 D90.1(K) R1.1
Net-(D71-1): D71.1 D87.1(K) Y1.1
Net-(D72-1): D72.1 D88.1(K) W1.1
Net-(D73-1): D73.1 D89.1(K) E1.1
Net-(D74-1): D74.1 D91.1(K) T1.1
Net-(D75-1): D75.1 D92.1(K) U1.1
Net-(D76-1): D76.1 D93.1(K) I1.1
Net-(D77-1): D77.1 D94.1(K) O1.1
Net-(D78-1): D78.1 D95.1(K) P1.1
Net-(D80-1): D80.1 D97.1(K) }]1.1
Net-(D82-1): D82.1 D98.1(K) DEL1.1
Net-(D83-1): D83.1 D99.1(K) PGDN1.1
Net-(D103-1): D103.1 D118.1(K) S1.1
Net-(D104-1): D104.1 D116.1(K) L1.1
Net-(D108-1): D108.1 D121.1(K) G1.1
Net-(D109-1): D109.1 D122.1(K) H1.1
Net-(D110-1): D110.1 D123.1(K) J1.1
Net-(D111-1): D111.1 D124.1(K) K1.1
Net-(D113-1): D113.1 D126.1(K) ENTER1.1
Net-(D127-1): D127.1 D137.1(K) UPAROW1.1
Net-(D130-1): D130.1 D138.1(K) V1.1
Net-(D132-1): D132.1 D140.1(K) N1.1
Net-(D133-1): D133.1 D141.1(K) M1.1
Net-(D136-1): D136.1 D148.1(K) X1.1
Net-(D145-1): D145.1 D149.1(K) SHIFTR1.1
Net-(D147-1): D147.1 D151.1(K) SHIFTL1.1
Net-(D150-1): D150.1 D152.1(K) Z1.1
Net-(D153-1): D153.1 D160.1(K) RGHTARW1.1
Net-(D154-1): D154.1 D162.1(K) MENU1.1
Net-(D155-1): D155.1 D163.1(K) LEFTARW1.1
Net-(D156-1): D156.1 D164.1(K) DNARW1.1
Net-(D157-1): D157.1 D165.1(K) OSL1.1
Net-(D158-1): D158.1 D166.1(K) SPACE1.1
Net-(D159-1): D159.1 D161.1(K) OSR1.1
Net-(LED1-1): LED1.1(A) RST1.1
Net-(LED2-1): LED2.1(A) RST2.1
Net-(R2-2): R2.2 USB2.3(CC1)
Net-(R3-1): R3.1 USB2.10(CC2)
Net-(RPP-32): RPP.32(GP27) RST1.2
Net-(RPP-34): RPP.34(GP28) RST2.2
Net-(RPP-44): RPP.44(BOOTSEL TP6) SW1.2
Net-(U2-15): U2.15(XOUT) X2.1(OSC1)
Net-(U2-16): U2.16(XIN) X2.2(OSC2)

Not connected (* = marked no-connect by the designer): RPP 30(RUN)* 33(AGND)* 35(VREF)* 36(OUT)* 37(EN)* 39(VSYS)* 43(GP25 TP5)*; SW1 3* 4*; U2 1(DM4)* 2(DP4)*; USB1 4(ID)*

## Notes on the sheets
sheet 1
- 0
- 1
- 2
- 3
- 4
- 5
- 6
- 7
- 8
- 9
- 10
- 11
- 12
- 13
- 14
- 15
- 16
- 17
- 0
- 2
- 3
- 4
- 5
- 6
sheet 2
- Caps by downstream USB ports
- 4 port USB 2.0 hub IC
- Slave USB ports
- USB Mini B for input
  without USB hub
- USB C input to USB hub IC
- Stabilizers for wide keys
